# Altium schematic sheet TColour2to3.SchDoc
size A4; Organization: Altium Limited; Address1: L3, 12a Rodborough Rd; Address2: Frenchs Forest; Address3: NSW; Address4: Australia 2086; DocumentNumber: 4; SheetNumber: 4; SheetTotal: 7
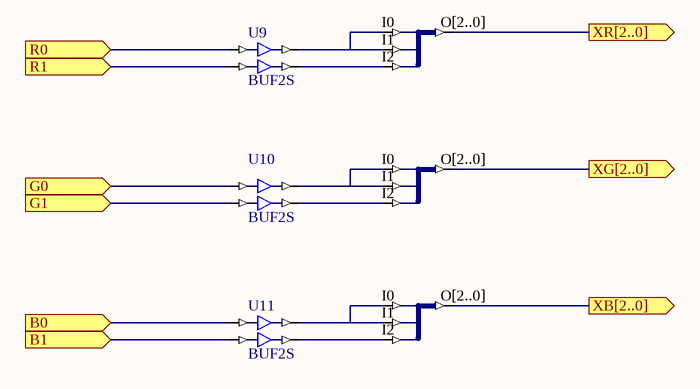
[diagram p0: TColour2to3.SchDoc]

## Parts
U6  J3S_3B  (value not drawn)
U7  J3S_3B  (value not drawn)
U8  J3S_3B  (value not drawn)
U9  BUF2S
U10  BUF2S
U11  BUF2S

## Ports
B0 (in), B1 (in), G0 (in), G1 (in), R0 (in), R1 (in), XB[2..0] (out), XG[2..0] (out), XR[2..0] (out)

## Nets
B0: U11.I0 ; port B0
B1: U11.I1 ; port B1
G0: U10.I0 ; port G0
G1: U10.I1 ; port G1
R0: U9.I0 ; port R0
R1: U9.I1 ; port R1
XB[2..0]: U8.O[2..0] ; port XB[2..0]
XG[2..0]: U7.O[2..0] ; port XG[2..0]
XR[2..0]: U6.O[2..0] ; port XR[2..0]
NetU6_I0: U6.I0 U6.I1 U9.O0
NetU6_I2: U6.I2 U9.O1
NetU7_I0: U7.I0 U7.I1 U10.O0
NetU7_I2: U7.I2 U10.O1
NetU8_I0: U8.I0 U8.I1 U11.O0
NetU8_I2: U8.I2 U11.O1

## Notes on the sheet
- Title
- Size:
- Date:
- A4
- Number:
- Time:
- Revision:
- Sheet
- of
- File:

## Library data of the parts
U6-U8 = J3S_3B: 3 Single pin inputs to single 3-Bit output bus; ArchiveName: GENERIC; VHDLIB_SIM: GENERIC_LIB; Published: 29-Jan-2004; Publisher: Altium Limited; Core Revision: 1.00.00
U9-U11 = BUF2S: 2-Bit General Purpose (Non-inverting) Buffer, Single Pin Version; ArchiveName: GENERIC; VHDLIB_SIM: GENERIC_LIB; Published: 29-Jan-2004; Publisher: Altium Limited; Core Revision: 1.00.00